# EAGLE design ATmega16-TQFP44-breakout (EAGLE 7.7.0)
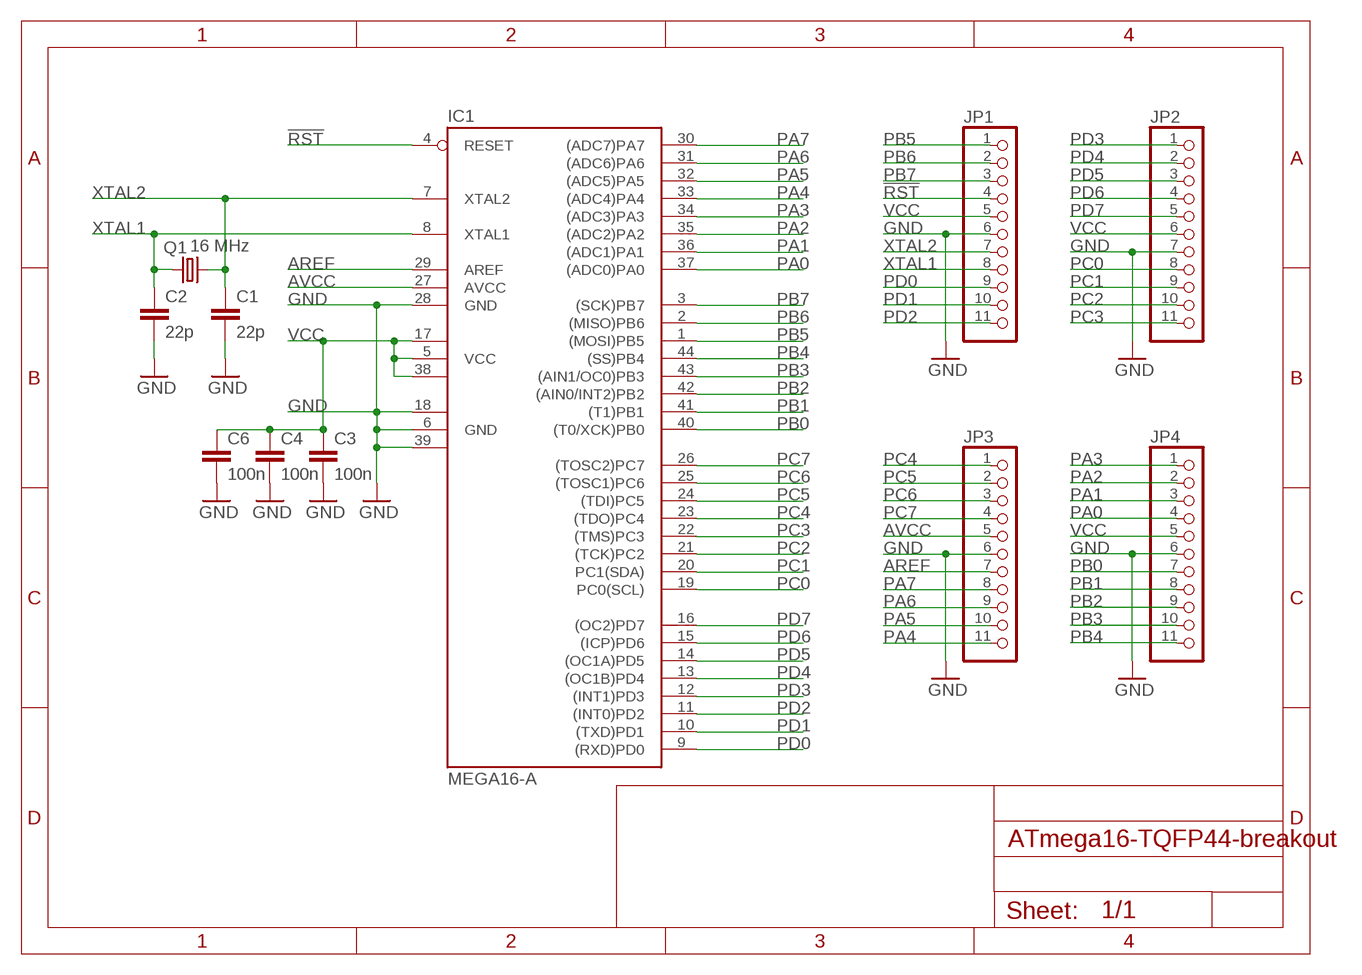
[diagram p0: schematic, sheet 1]

## Parts
C1  22p  C-EUC1206  [C1206]
C2  22p  C-EUC1206  [C1206]
C3  100n  C-EUC1206  [C1206]
C4  100n  C-EUC1206  [C1206]
C6  100n  C-EUC1206  [C1206]
IC1  MEGA16-A  [TQFP44]
JP1  PINHD-1X11  [1X11]
JP2  PINHD-1X11  [1X11]
JP3  PINHD-1X11  [1X11]
JP4  PINHD-1X11  [1X11]
Q1  16 MHz  CRYSTALHC49S  [HC49/S]

## Nets
!RST: IC1.4(RESET) JP1.4
AREF: IC1.29(AREF) JP3.7
AVCC: IC1.27(AVCC) JP3.5
GND: C1.2 C2.2 C3.2 C4.2 C6.2 IC1.6(GND) IC1.18(GND1) IC1.28(GND) IC1.39(GND2) JP1.6 JP2.7 JP3.6 JP4.6
PA0: IC1.37((ADC0)PA0) JP4.4
PA1: IC1.36((ADC1)PA1) JP4.3
PA2: IC1.35((ADC2)PA2) JP4.2
PA3: IC1.34((ADC3)PA3) JP4.1
PA4: IC1.33((ADC4)PA4) JP3.11
PA5: IC1.32((ADC5)PA5) JP3.10
PA6: IC1.31((ADC6)PA6) JP3.9
PA7: IC1.30((ADC7)PA7) JP3.8
PB0: IC1.40((T0/XCK)PB0) JP4.7
PB1: IC1.41((T1)PB1) JP4.8
PB2: IC1.42((AIN0/INT2)PB2) JP4.9
PB3: IC1.43((AIN1/OC0)PB3) JP4.10
PB4: IC1.44((SS)PB4) JP4.11
PB5: IC1.1((MOSI)PB5) JP1.1
PB6: IC1.2((MISO)PB6) JP1.2
PB7: IC1.3((SCK)PB7) JP1.3
PC0: IC1.19(PC0(SCL)) JP2.8
PC1: IC1.20(PC1(SDA)) JP2.9
PC2: IC1.21((TCK)PC2) JP2.10
PC3: IC1.22((TMS)PC3) JP2.11
PC4: IC1.23((TDO)PC4) JP3.1
PC5: IC1.24((TDI)PC5) JP3.2
PC6: IC1.25((TOSC1)PC6) JP3.3
PC7: IC1.26((TOSC2)PC7) JP3.4
PD0: IC1.9((RXD)PD0) JP1.9
PD1: IC1.10((TXD)PD1) JP1.10
PD2: IC1.11((INT0)PD2) JP1.11
PD3: IC1.12((INT1)PD3) JP2.1
PD4: IC1.13((OC1B)PD4) JP2.2
PD5: IC1.14((OC1A)PD5) JP2.3
PD6: IC1.15((ICP)PD6) JP2.4
PD7: IC1.16((OC2)PD7) JP2.5
VCC: C3.1 C4.1 C6.1 IC1.5(VCC) IC1.17(VCC1) IC1.38(VCC2) JP1.5 JP2.6 JP4.5
XTAL1: C2.1 IC1.8(XTAL1) JP1.8 Q1.1
XTAL2: C1.1 IC1.7(XTAL2) JP1.7 Q1.2

## Library data of the parts
C1-C4 C6 = rcl:C-EU: CAPACITOR, European symbol
IC1 = atmel:MEGA16: MICROCONTROLLER 16 Kbytes FLASH 1 kbytes SRAM 512 bytes EEPROM USART 8-channel 10 bit ADC Source: avr.lbr; MPN: ATMEGA16-16AU; OC_FARNELL: 9171134; OC_NEWARK: 96K6515
JP1-JP4 = pinhead:PINHD-1X11: PIN HEADER
Q1 = crystal:CRYSTAL: CRYSTAL; OC_FARNELL: 1667008; OC_NEWARK: unknown

## Board
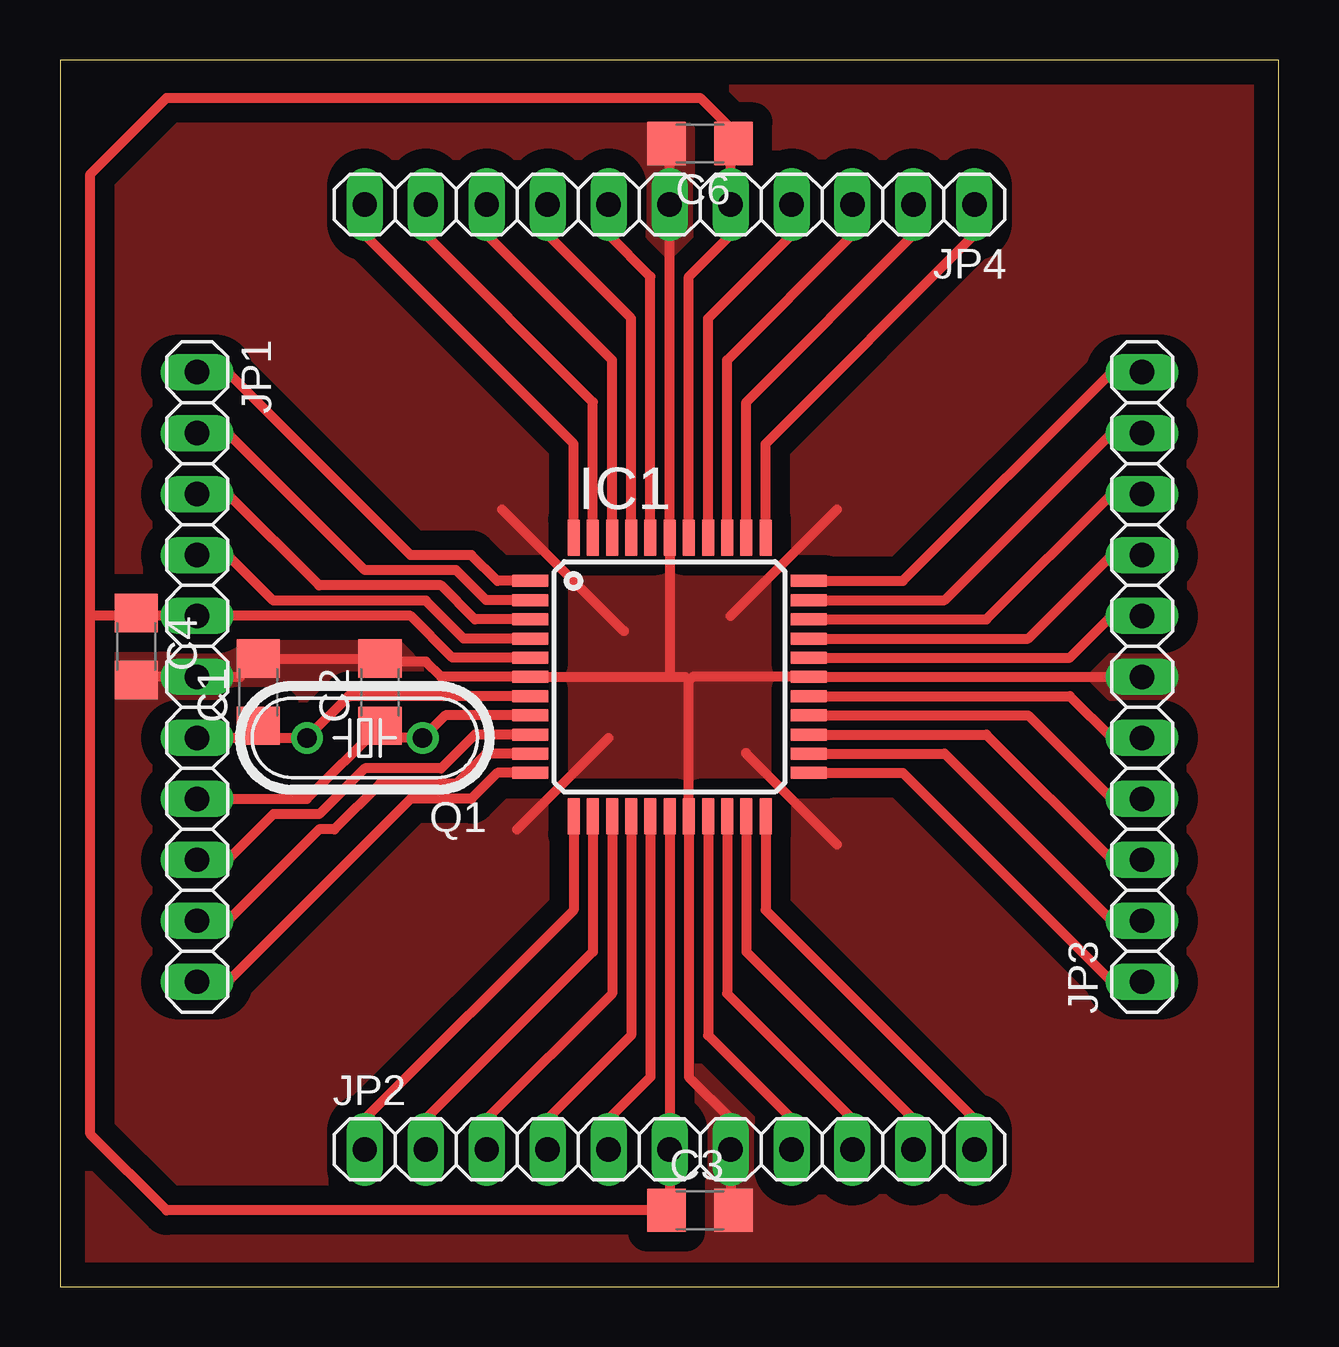
[diagram p1: board, top side]

Size 50.78 x 51.11 mm. Coordinates in mm from the lower left corner, seen from the top.
Outline: 0,0 50.78,0 50.78,51.11 0,51.11 0,0
Copper layers (1*16): Top 0.035mm / dielectric 1.5mm / Bottom 0.035mm
Design rules "default": minimum track width 10mil, minimum drill 24mil, track to track 8mil, track to pad 8mil, pad to pad 8mil, via to via 8mil, smd to smd 8mil, copper to edge 40mil, drill to drill 8mil, minimum pad ring 10mil, minimum via ring 8mil, stop-mask expansion 4mil, vias tented up to drill 0mil, thermal gap 10mil

### Footprints (pad centres in the part's own frame; a part is rotated, then mirrored left to right if it is on the bottom)
C1206 = smd 1.6 x 1.8: 1 -1.4,0; 2 1.4,0
TQFP44 = smd 1.5 x 0.5: 1 -5.8,4; 2 -5.8,3.2; 3 -5.8,2.4; 4 -5.8,1.6; 5 -5.8,0.8; 6 -5.8,0; 7 -5.8,-0.8; 8 -5.8,-1.6; 9 -5.8,-2.4; 10 -5.8,-3.2; 11 -5.8,-4; 23 5.8,-4; 24 5.8,-3.2; 25 5.8,-2.4; 26 5.8,-1.6; 27 5.8,-0.8; 28 5.8,0; 29 5.8,0.8; 30 5.8,1.6; 31 5.8,2.4; 32 5.8,3.2; 33 5.8,4 | smd 0.5 x 1.5: 12 -4,-5.8; 13 -3.2,-5.8; 14 -2.4,-5.8; 15 -1.6,-5.8; 16 -0.8,-5.8; 17 0,-5.8; 18 0.8,-5.8; 19 1.6,-5.8; 20 2.4,-5.8; 21 3.2,-5.8; 22 4,-5.8; 34 4,5.8; 35 3.2,5.8; 36 2.4,5.8; 37 1.6,5.8; 38 0.8,5.8; 39 0,5.8; 40 -0.8,5.8; 41 -1.6,5.8; 42 -2.4,5.8; 43 -3.2,5.8; 44 -4,5.8
1X11 = drill 1.016 long: 1 -12.7,0; 2 -10.16,0; 3 -7.62,0; 4 -5.08,0; 5 -2.54,0; 6 0,0; 7 2.54,0; 8 5.08,0; 9 7.62,0; 10 10.16,0; 11 12.7,0
HC49/S = drill 0.813: 1 -2.413,0; 2 2.413,0

### Placement (x,y rotation side)
C1  8.26,24.77 90 top
C2  13.34,24.77 90 top
C3  26.67,3.18 0 top
C4  3.18,26.67 270 top
C6  26.67,47.62 180 top
IC1  25.4,25.4 0 top
JP1  5.72,25.4 270 top
JP2  25.4,5.71 0 top
JP3  45.09,25.4 90 top
JP4  25.4,45.08 180 top
Q1  12.7,22.86 180 top

### Tracks (layer width: path | path; a pad name or v marks a point on that pad's centre or on a via)
!RST
  Top 0.406: IC1.4 16.81,27 15.24,28.58 8.89,28.58 6.98,30.48 JP1.4
AREF
  Top 0.406: IC1.29 42.08,26.2 43.81,27.94 JP3.7
AVCC
  Top 0.406: IC1.27 42.08,24.6 43.81,22.86 JP3.5
GND
  Top 0.406: JP3.6 IC1.28 26.37,25.4 26.2,25.23 | 26.2,25.23 IC1.18 26.2,8.73 27.94,6.98 JP2.7 27.94,3.3 C3.2 | 26.2,25.23 26.04,25.4 25.4,25.4 | 25.4,25.4 IC1.39 JP4.6 25.4,47.5 C6.2 | 25.4,25.4 IC1.6 15.88,25.4 15.24,26.03 13.47,26.03 C2.2 C1.2 7.49,25.4 JP1.6 3.3,25.4 C4.2 | 18.41,32.38 23.5,27.3 | 27.94,27.94 32.38,32.38 | 28.58,22.23 32.38,18.41 | 22.86,22.86 19.05,19.05
  pour Top: 21.59,29.21 29.21,29.21 29.21,21.59 21.59,21.59
  pour Top (isolate 0.813, no thermals): 0,50.8 50.8,50.8 50.8,0 0,0
PA0
  Top 0.406: IC1.37 27,40.33 30.48,43.81 JP4.4
PA1
  Top 0.406: IC1.36 27.8,38.59 33.02,43.81 JP4.3
PA2
  Top 0.406: IC1.35 28.6,36.85 35.56,43.81 JP4.2
PA3
  Top 0.406: IC1.34 29.4,35.12 38.1,43.81 JP4.1
PA4
  Top 0.406: IC1.33 35.11,29.4 43.81,38.1 JP3.11
PA5
  Top 0.406: IC1.32 36.86,28.6 43.81,35.56 JP3.10
PA6
  Top 0.406: IC1.31 38.59,27.8 43.81,33.02 JP3.9
PA7
  Top 0.406: IC1.30 40.34,27 43.81,30.48 JP3.8
PB0
  Top 0.406: IC1.40 24.6,42.08 22.86,43.81 JP4.7
PB1
  Top 0.406: IC1.41 23.8,40.33 20.32,43.81 JP4.8
PB2
  Top 0.406: IC1.42 23,38.59 17.78,43.81 JP4.9
PB3
  Top 0.406: IC1.43 22.2,36.85 15.24,43.81 JP4.10
PB4
  Top 0.406: IC1.44 21.4,35.12 12.7,43.81 JP4.11
PB5
  Top 0.406: IC1.1 18.23,29.4 17.15,30.48 14.61,30.48 6.98,38.1 JP1.1
PB6
  Top 0.406: IC1.2 17.76,28.6 16.51,29.84 12.7,29.84 6.98,35.56 JP1.2
PB7
  Top 0.406: IC1.3 17.29,27.8 15.88,29.21 10.8,29.21 6.98,33.02 JP1.3
PC0
  Top 0.406: IC1.19 27,10.46 30.48,6.98 JP2.8
PC1
  Top 0.406: IC1.20 27.8,12.2 33.02,6.98 JP2.9
PC2
  Top 0.406: IC1.21 28.6,13.95 35.56,6.98 JP2.10
PC3
  Top 0.406: IC1.22 29.4,15.69 38.1,6.98 JP2.11
PC4
  Top 0.406: IC1.23 35.11,21.4 43.81,12.7 JP3.1
PC5
  Top 0.406: IC1.24 36.86,22.2 43.81,15.24 JP3.2
PC6
  Top 0.406: IC1.25 38.59,23 43.81,17.78 JP3.3
PC7
  Top 0.406: IC1.26 40.34,23.8 43.81,20.32 JP3.4
PD0
  Top 0.406: IC1.9 17.29,23 15.88,21.59 12.7,21.59 10.8,19.69 8.89,19.69 6.98,17.78 JP1.9
PD1
  Top 0.406: IC1.10 17.76,22.2 16.51,20.95 13.34,20.95 11.43,19.05 10.8,19.05 6.98,15.24 JP1.10
PD2
  Top 0.406: IC1.11 18.23,21.4 17.15,20.32 14.61,20.32 6.98,12.7 JP1.11
PD3
  Top 0.406: IC1.12 21.4,15.69 12.7,6.98 JP2.1
PD4
  Top 0.406: IC1.13 22.2,13.95 15.24,6.98 JP2.2
PD5
  Top 0.406: IC1.14 23,12.2 17.78,6.98 JP2.3
PD6
  Top 0.406: IC1.15 23.8,10.46 20.32,6.98 JP2.4
PD7
  Top 0.406: IC1.16 24.6,8.73 22.86,6.98 JP2.5
VCC
  Top 0.406: IC1.38 26.2,42.08 27.94,43.81 JP4.5 27.94,47.5 C6.1 27.94,47.75 27.94,48.26 26.67,49.53 4.45,49.53 1.27,46.36 1.27,27.94 | C3.1 25.4,3.3 JP2.6 IC1.17 25.4,3.18 4.45,3.18 1.27,6.35 1.27,27.94 | JP1.5 14.61,27.94 16.34,26.2 IC1.5 | JP1.5 3.3,27.94 C4.1 | JP1.5 1.27,27.94
XTAL1
  Top 0.406: IC1.8 16.05,23.8 Q1.1 13.84,22.86 C2.1 10.29,20.32 JP1.8
XTAL2
  Top 0.406: IC1.7 12.03,24.6 Q1.2 8.26,22.86 | JP1.7 8.26,22.86 | C1.1 8.26,22.86